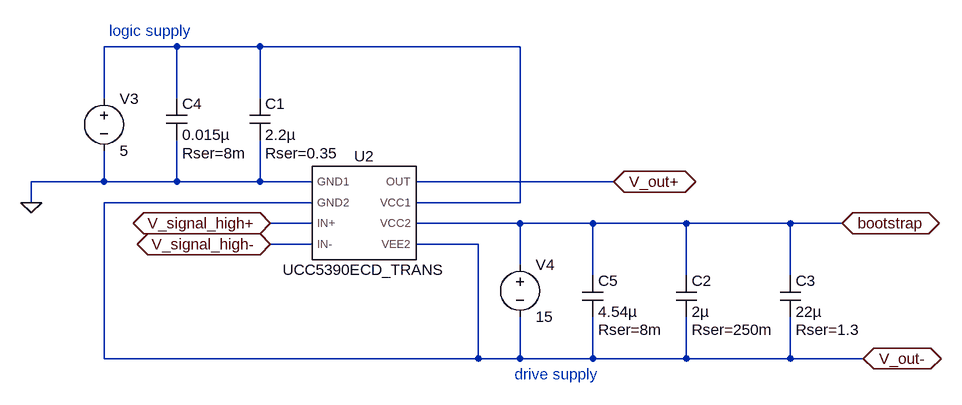
[diagram p0: schematic GateDriverLow.asc]
GateDriverLow.asc, the LTspice schematic file:
Version 4.1
SHEET 1 1132 1192
WIRE -80 496 -192 496
WIRE 48 496 -80 496
WIRE 448 496 48 496
WIRE -192 576 -192 496
WIRE -80 576 -80 496
WIRE 48 576 48 496
WIRE -192 704 -192 656
WIRE -192 704 -304 704
WIRE -80 704 -80 640
WIRE -80 704 -192 704
WIRE 48 704 48 640
WIRE 48 704 -80 704
WIRE 128 704 48 704
WIRE 592 704 288 704
WIRE -304 736 -304 704
WIRE 128 736 -192 736
WIRE 448 736 448 496
WIRE 448 736 288 736
WIRE 128 768 64 768
WIRE 448 768 288 768
WIRE 560 768 448 768
WIRE 704 768 560 768
WIRE 864 768 704 768
WIRE 944 768 864 768
WIRE 128 800 64 800
WIRE 384 800 288 800
WIRE 448 832 448 768
WIRE 560 848 560 768
WIRE 704 848 704 768
WIRE 864 848 864 768
WIRE -192 976 -192 736
WIRE 384 976 384 800
WIRE 384 976 -192 976
WIRE 448 976 448 912
WIRE 448 976 384 976
WIRE 560 976 560 912
WIRE 560 976 448 976
WIRE 704 976 704 912
WIRE 704 976 560 976
WIRE 864 976 864 912
WIRE 864 976 704 976
WIRE 976 976 864 976
FLAG 592 704 V_out+
IOPIN 592 704 BiDir
FLAG 64 768 V_signal_high+
IOPIN 64 768 BiDir
FLAG 64 800 V_signal_high-
IOPIN 64 800 BiDir
FLAG 976 976 V_out-
IOPIN 976 976 BiDir
FLAG -304 736 0
FLAG 944 768 bootstrap
IOPIN 944 768 BiDir
SYMBOL UCC5390ECD_TRANS 208 752 R0
SYMATTR InstName U2
SYMBOL voltage -192 560 R0
WINDOW 123 0 0 Left 0
WINDOW 39 0 0 Left 0
SYMATTR InstName V3
SYMATTR Value 5
SYMBOL cap -96 576 R0
WINDOW 39 24 84 Left 2
SYMATTR SpiceLine Rser=8m
SYMATTR InstName C4
SYMATTR Value 0.015µ
SYMBOL voltage 448 816 R0
WINDOW 123 0 0 Left 0
WINDOW 39 0 0 Left 0
SYMATTR InstName V4
SYMATTR Value 15
SYMBOL cap 544 848 R0
WINDOW 39 24 84 Left 2
SYMATTR SpiceLine Rser=8m
SYMATTR InstName C5
SYMATTR Value 4.54µ
SYMBOL cap 32 576 R0
WINDOW 39 24 84 Left 2
SYMATTR SpiceLine Rser=0.35
SYMATTR InstName C1
SYMATTR Value 2.2µ
SYMBOL cap 688 848 R0
WINDOW 39 24 84 Left 2
SYMATTR SpiceLine Rser=250m
SYMATTR InstName C2
SYMATTR Value 2µ
SYMBOL cap 848 848 R0
WINDOW 39 24 84 Left 2
SYMATTR SpiceLine Rser=1.3
SYMATTR InstName C3
SYMATTR Value 22µ
TEXT -184 472 Left 2 ;logic supply
TEXT 440 1000 Left 2 ;drive supply

The netlist it stands for:
* GateDriverLow.asc
X§U2 0 V_out- V_signal_high+ V_signal_high- V_out+ N001 bootstrap V_out- UCC5390ECD_TRANS  ; pins GND1 GND2 IN+ IN- OUT VCC1 VCC2 VEE2
V3 N001 0 5
C4 N001 0 0.015µ Rser=8m
V4 bootstrap V_out- 15
C5 bootstrap V_out- 4.54µ Rser=8m
C1 N001 0 2.2µ Rser=0.35
C2 bootstrap V_out- 2µ Rser=250m
C3 bootstrap V_out- 22µ Rser=1.3
* logic supply
* drive supply
.lib UCC5390ECD_TRANS.LIB
.backanno
.end